# Altium schematic sheet RS485.SchDoc: Płytka rozwojowa STM
size A4; Author1: Łukasz Wawrzyniak; Organization: Politechnika Łódzka; Address1: WEEIA; Address2: Elektronika i Telekomunikacja; Address3: Semestr zimowy 2021/2022; Address4: Stopień II; Revision: -; SheetNumber: 5; SheetTotal: 7; Author2: Mateusz Melka; Title2: Zaawansowane narzędzia CAD/EDA; Author5: Maciej Figiel; Author4: Michał Skurpel; Author3: Jakub Korzeniowski; Index1: 239499; Index2: 239488; Index3: 239436; Index4: 239457; Index5: 239473
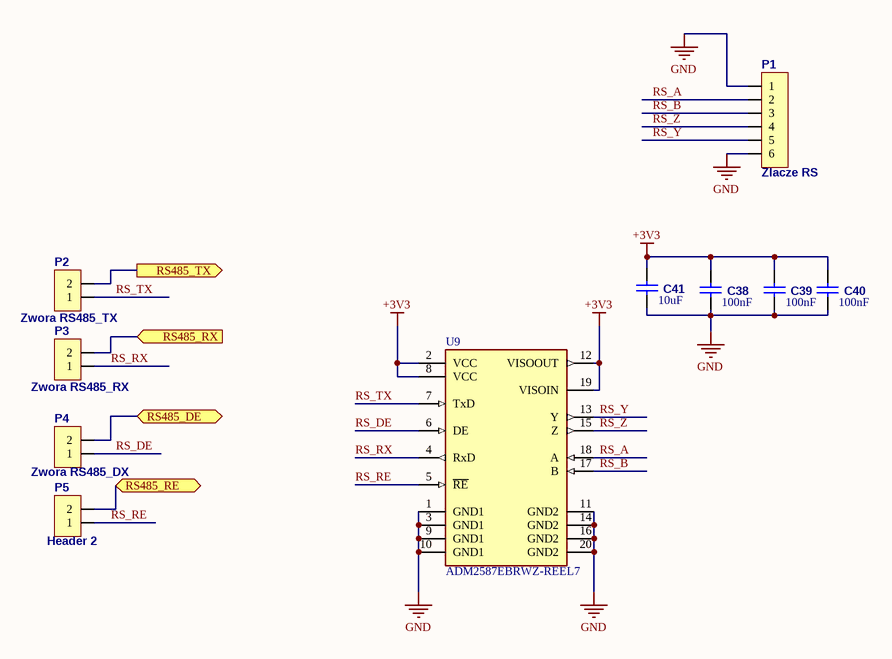
[diagram p0: RS485.SchDoc]

## Parts
C38  100nF  [0805]
C39  100nF  [0805]
C40  100nF  [0805]
C41  10uF  [0805]
P1  Zlacze RS  [GP_6x1]
P2  Zwora RS485_TX  [GP_2x1_2mm]
P3  Zwora RS485_RX  [GP_2x1_2mm]
P4  Zwora RS485_DX  [GP_2x1_2mm]
P5  Header 2  [GP_2x1_2mm]
U9  ADM2587EBRWZ-REEL7  [FP-RW-20-IPC_C]

## Ports
RS485_DE (bidir), RS485_RE (bidir), RS485_RX (in), RS485_TX (out)

## Nets
+3V3: C38.2 C39.2 C40.2 C41.2 U9.2(VCC) U9.8(VCC) U9.12(VISOOUT) U9.19(VISOIN)
GND: C38.1 C39.1 C40.1 C41.1 P1.1 P1.6 U9.1(GND1) U9.3(GND1) U9.9(GND1) U9.10(GND1) U9.11(GND2) U9.14(GND2) U9.16(GND2) U9.20(GND2)
RS485_DE: P4.2 ; port RS485_DE
RS485_RE: P5.2 ; port RS485_RE
RS485_RX: P3.2 ; port RS485_RX
RS485_TX: P2.2 ; port RS485_TX
RS_A: P1.2 U9.18(A)
RS_B: P1.3 U9.17(B)
RS_DE: P4.1 U9.6(DE)
RS_RE: P5.1 U9.5(~{RE})
RS_RX: P3.1 U9.4(RxD)
RS_TX: P2.1 U9.7(TxD)
RS_Y: P1.5 U9.13(Y)
RS_Z: P1.4 U9.15(Z)

## Notes on the sheet
- Title:
- Organisation:
- Authors:
- Size:
- Time:
- A4
- Number:
- Date:
- Revision:
- Sheet
- of
- File:

## Library data of the parts
C38-C40 = Cap: Ceramic capacitor MLCC SMD ±1%; ComponentLink1Description: datasheet; ComponentLink2Description: supplier; Value: 100nF
C41 = Cap: Ceramic capacitor MLCC SMD ±1%; Value: 100nF; ComponentLink1Description: datasheet; ComponentLink2Description: supplier
P1 = CN_6x1
P2-P5 = CN_2x1
U9 = CMP-09096-000011-1: DGTL ISO RS422/RS485 20SOIC TME@ADM2587EBRWZ-REEL7; Manufacturer: Analog Devices; Min Supply Voltage: 3.3V; Simplex Duplex: Full Duplex; Nominal Supply Current: 72-125mA; Data Rate: 500kbits/s; Number Of Receivers: 1; Interface: RS-485,RS-422; Max Supply Voltage: 5V; Standoff Height: 0.1mm; Package: RW-20; ComponentLink2Description: Datasheet; Digikey Description: DGTL ISO RS422/RS485 20SOIC; Ipc Land Pattern Name: SOIC127P1032X250-20; Automotive: No; Octopart: https://octopart.com/adm2587ebrwz-reel7-analog+devices-12809043; Device Class L3: RS-232 / RS-422 / RS-485 Interface ICs; Temperature: -40°C to +85°C; Lead Free: Yes; ComponentLink2URL: https://www.analog.com/media/en/technical-documentation/data-sheets/adm2582e_2587e.pdf; RoHS: TRUE; Manufacturer Part Number: ADM2587EBRWZ-REEL7; Temperature Range Low: -40°C; Height: 2.65mm; Temperature Range High: +85°C; Mouser Description: Digital Isolators 2.5kV Sgnl & Pwr Iso Full/Hlf Duplx; Device Class L2: Interface ICs; Device Class L1: Integrated Circuits (ICs); Number Of Transmitters: 1; Category: IC; ComponentLink3Description: TME; ComponentLink3URL: https://www.tme.eu/pl/details/adm2587ebrwz-reel7/uklady-scalone-interfejs-rs232-422-485/analog-devices/